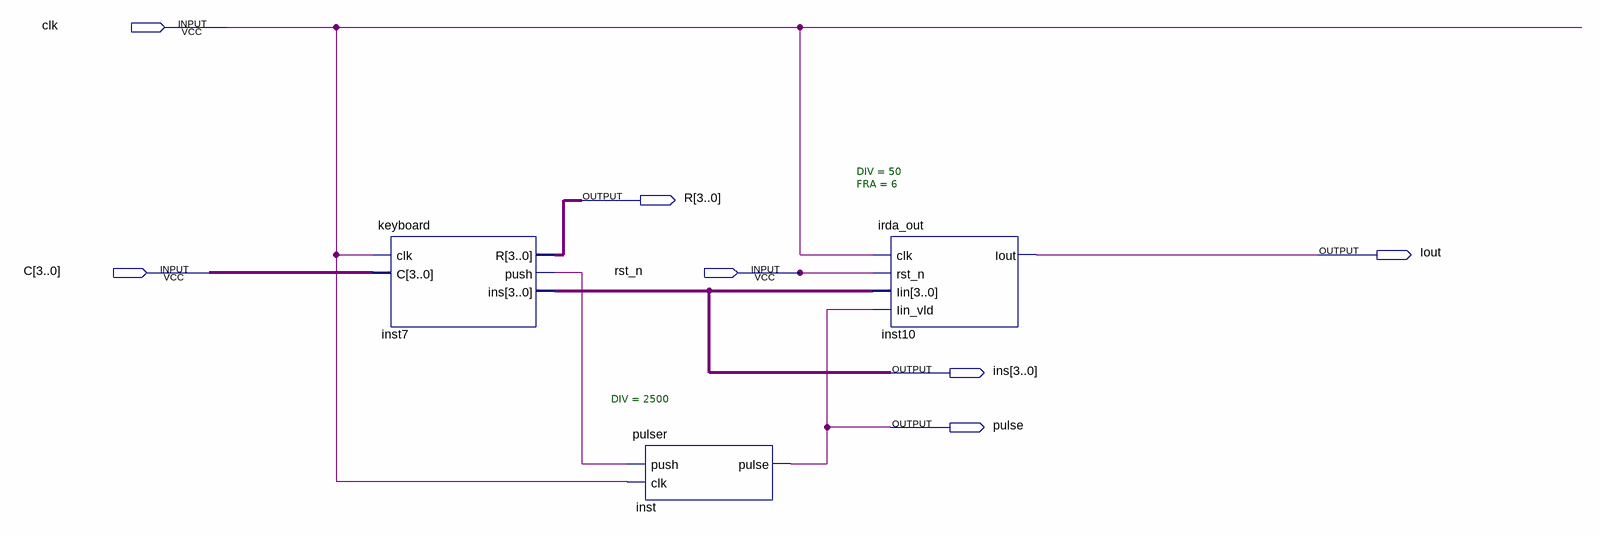
[diagram p0: schematic sheet]
// Quartus schematic irda.bdf as structural Verilog: 3 symbols, 7 pins
module irda (
  input  clk,
  input  [3:0] C,
  input  rst_n,
  output [3:0] R,
  output Iout,
  output [3:0] ins,
  output pulse
);

  wire inst7_push;

  keyboard inst7 (.clk(clk), .C(C), .R(R), .push(inst7_push), .ins(ins));
  pulser #(.DIV(2500)) inst (.push(inst7_push), .clk(clk), .pulse(pulse));
  irda_out #(.DIV(50), .FRA(6)) inst10 (.clk(clk), .rst_n(rst_n), .Iin(ins), .Iin_vld(pulse), .Iout(Iout));
endmodule
